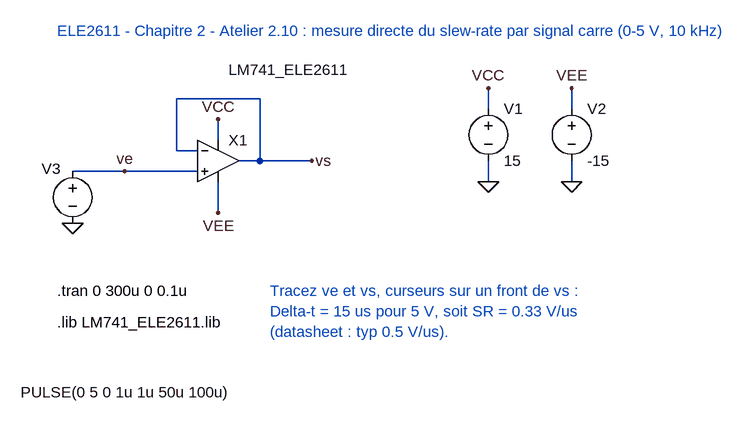
[diagram p0: schematic Ch2_Atelier_2_10_SlewRate.asc]
Ch2_Atelier_2_10_SlewRate.asc, the LTspice schematic file:
Version 4
SHEET 1 1200 700
WIRE 352 240 384 240
WIRE 384 144 384 240
WIRE 256 144 384 144
WIRE 256 144 256 224
WIRE 256 224 288 224
WIRE 320 176 320 208
WIRE 320 272 320 320
WIRE 384 240 464 240
WIRE 96 256 176 256
WIRE 176 256 288 256
WIRE 736 128 736 160
WIRE 736 240 736 272
WIRE 864 128 864 160
WIRE 864 240 864 272
FLAG 320 176 VCC
FLAG 320 320 VEE
FLAG 464 240 vs
FLAG 96 336 0
FLAG 176 256 ve
FLAG 736 128 VCC
FLAG 736 272 0
FLAG 864 128 VEE
FLAG 864 272 0
SYMBOL Opamps\\opamp2 320 176 R0
WINDOW 3 16 -76 Left 2
SYMATTR InstName X1
SYMATTR Value LM741_ELE2611
SYMBOL voltage 96 240 R0
WINDOW 0 -48 12 Left 2
WINDOW 3 -80 356 Left 2
SYMATTR InstName V3
SYMATTR Value PULSE(0 5 0 1u 1u 50u 100u)
SYMBOL voltage 736 144 R0
SYMATTR InstName V1
SYMATTR Value 15
SYMBOL voltage 864 144 R0
SYMATTR InstName V2
SYMATTR Value -15
TEXT 72 40 Left 2 ;ELE2611 - Chapitre 2 - Atelier 2.10 : mesure directe du slew-rate par signal carre (0-5 V, 10 kHz)
TEXT 72 440 Left 2 !.tran 0 300u 0 0.1u
TEXT 72 488 Left 2 !.lib LM741_ELE2611.lib
TEXT 400 440 Left 2 ;Tracez ve et vs, curseurs sur un front de vs :\nDelta-t = 15 us pour 5 V, soit SR = 0.33 V/us\n(datasheet : typ 0.5 V/us).

The netlist it stands for:
* Ch2_Atelier_2_10_SlewRate.asc
XX1 ve vs VCC VEE vs LM741_ELE2611  ; pins In+ In- V+ V- OUT
V3 ve 0 PULSE(0 5 0 1u 1u 50u 100u)
V1 VCC 0 15
V2 VEE 0 -15
* ELE2611 - Chapitre 2 - Atelier 2.10 : mesure directe du slew-rate par signal carre (0-5 V, 10 kHz)
.tran 0 300u 0 0.1u
.lib LM741_ELE2611.lib
* Tracez ve et vs, curseurs sur un front de vs :
* Delta-t = 15 us pour 5 V, soit SR = 0.33 V/us
* (datasheet : typ 0.5 V/us).
.backanno
.end